# Altium schematic sheet Airbrake Motor Controller main.SchDoc
size A
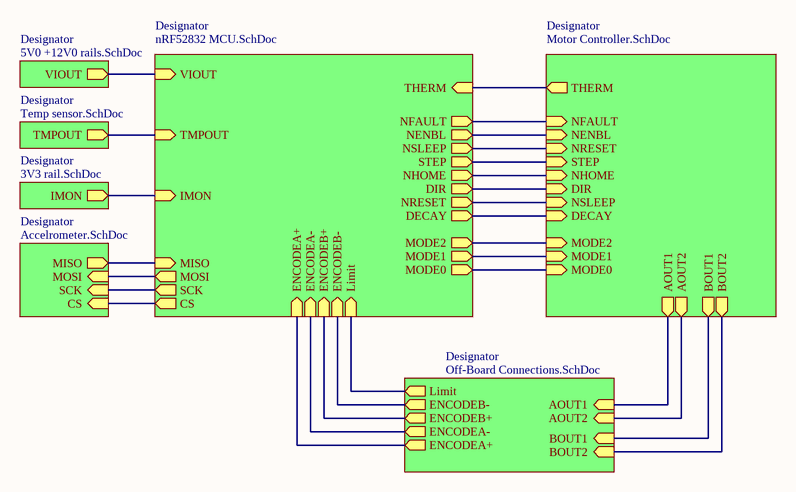
[diagram p0: Airbrake Motor Controller main.SchDoc]

## Sub-sheets
Designator = 5V0 +12V0 rails.SchDoc: VIOUT (out)
Designator = 3V3 rail.SchDoc: IMON (out)
Designator = Motor Controller.SchDoc: DIR (in), DECAY (in), NENBL (in), NFAULT (in), NHOME (in), NRESET (in), NSLEEP (in), STEP (in), MODE0 (in), MODE1 (in), MODE2 (in), THERM (out), BOUT1 (out), BOUT2 (out), AOUT1 (out), AOUT2 (out)
Designator = nRF52832 MCU.SchDoc: ENCODEA+ (in), ENCODEB+ (in), ENCODEA- (in), ENCODEB- (in), NFAULT (out), VIOUT (in), CS (out), NENBL (out), NSLEEP (out), STEP (out), SCK (out), MODE2 (out), MOSI (out), NHOME (out), MISO (in), TMPOUT (in), DIR (out), IMON (in), NRESET (out), MODE0 (out), THERM (in), DECAY (out), MODE1 (out), Limit (in)
Designator = Accelrometer.SchDoc: MOSI (in), CS (in), MISO (out), SCK (in)
Designator = Off-Board Connections.SchDoc: BOUT1 (in), ENCODEA- (out), ENCODEA+ (out), BOUT2 (in), ENCODEB- (out), ENCODEB+ (out), AOUT1 (in), AOUT2 (in), Limit (out)
Designator = Temp sensor.SchDoc: TMPOUT (out)

## Nets
(unnamed): sheet Designator/VIOUT, sheet Designator/VIOUT
(unnamed): sheet Designator/IMON, sheet Designator/IMON
(unnamed): sheet Designator/DIR, sheet Designator/DIR
(unnamed): sheet Designator/DECAY, sheet Designator/DECAY
(unnamed): sheet Designator/NENBL, sheet Designator/NENBL
(unnamed): sheet Designator/NFAULT, sheet Designator/NFAULT
(unnamed): sheet Designator/NHOME, sheet Designator/NHOME
(unnamed): sheet Designator/NRESET, sheet Designator/NSLEEP
(unnamed): sheet Designator/NSLEEP, sheet Designator/NRESET
(unnamed): sheet Designator/STEP, sheet Designator/STEP
(unnamed): sheet Designator/MODE0, sheet Designator/MODE0
(unnamed): sheet Designator/MODE1, sheet Designator/MODE1
(unnamed): sheet Designator/MODE2, sheet Designator/MODE2
(unnamed): sheet Designator/THERM, sheet Designator/THERM
(unnamed): sheet Designator/BOUT1, sheet Designator/BOUT1
(unnamed): sheet Designator/BOUT2, sheet Designator/BOUT2
(unnamed): sheet Designator/AOUT1, sheet Designator/AOUT1
(unnamed): sheet Designator/AOUT2, sheet Designator/AOUT2
(unnamed): sheet Designator/ENCODEA+, sheet Designator/ENCODEA+
(unnamed): sheet Designator/ENCODEB+, sheet Designator/ENCODEB+
(unnamed): sheet Designator/ENCODEA-, sheet Designator/ENCODEA-
(unnamed): sheet Designator/ENCODEB-, sheet Designator/ENCODEB-
(unnamed): sheet Designator/CS, sheet Designator/CS
(unnamed): sheet Designator/SCK, sheet Designator/SCK
(unnamed): sheet Designator/MOSI, sheet Designator/MOSI
(unnamed): sheet Designator/MISO, sheet Designator/MISO
(unnamed): sheet Designator/TMPOUT, sheet Designator/TMPOUT
(unnamed): sheet Designator/Limit, sheet Designator/Limit